# Altium schematic sheet Rolling_door.SchDoc
size A3; SheetNumber: 1; SheetTotal: 2
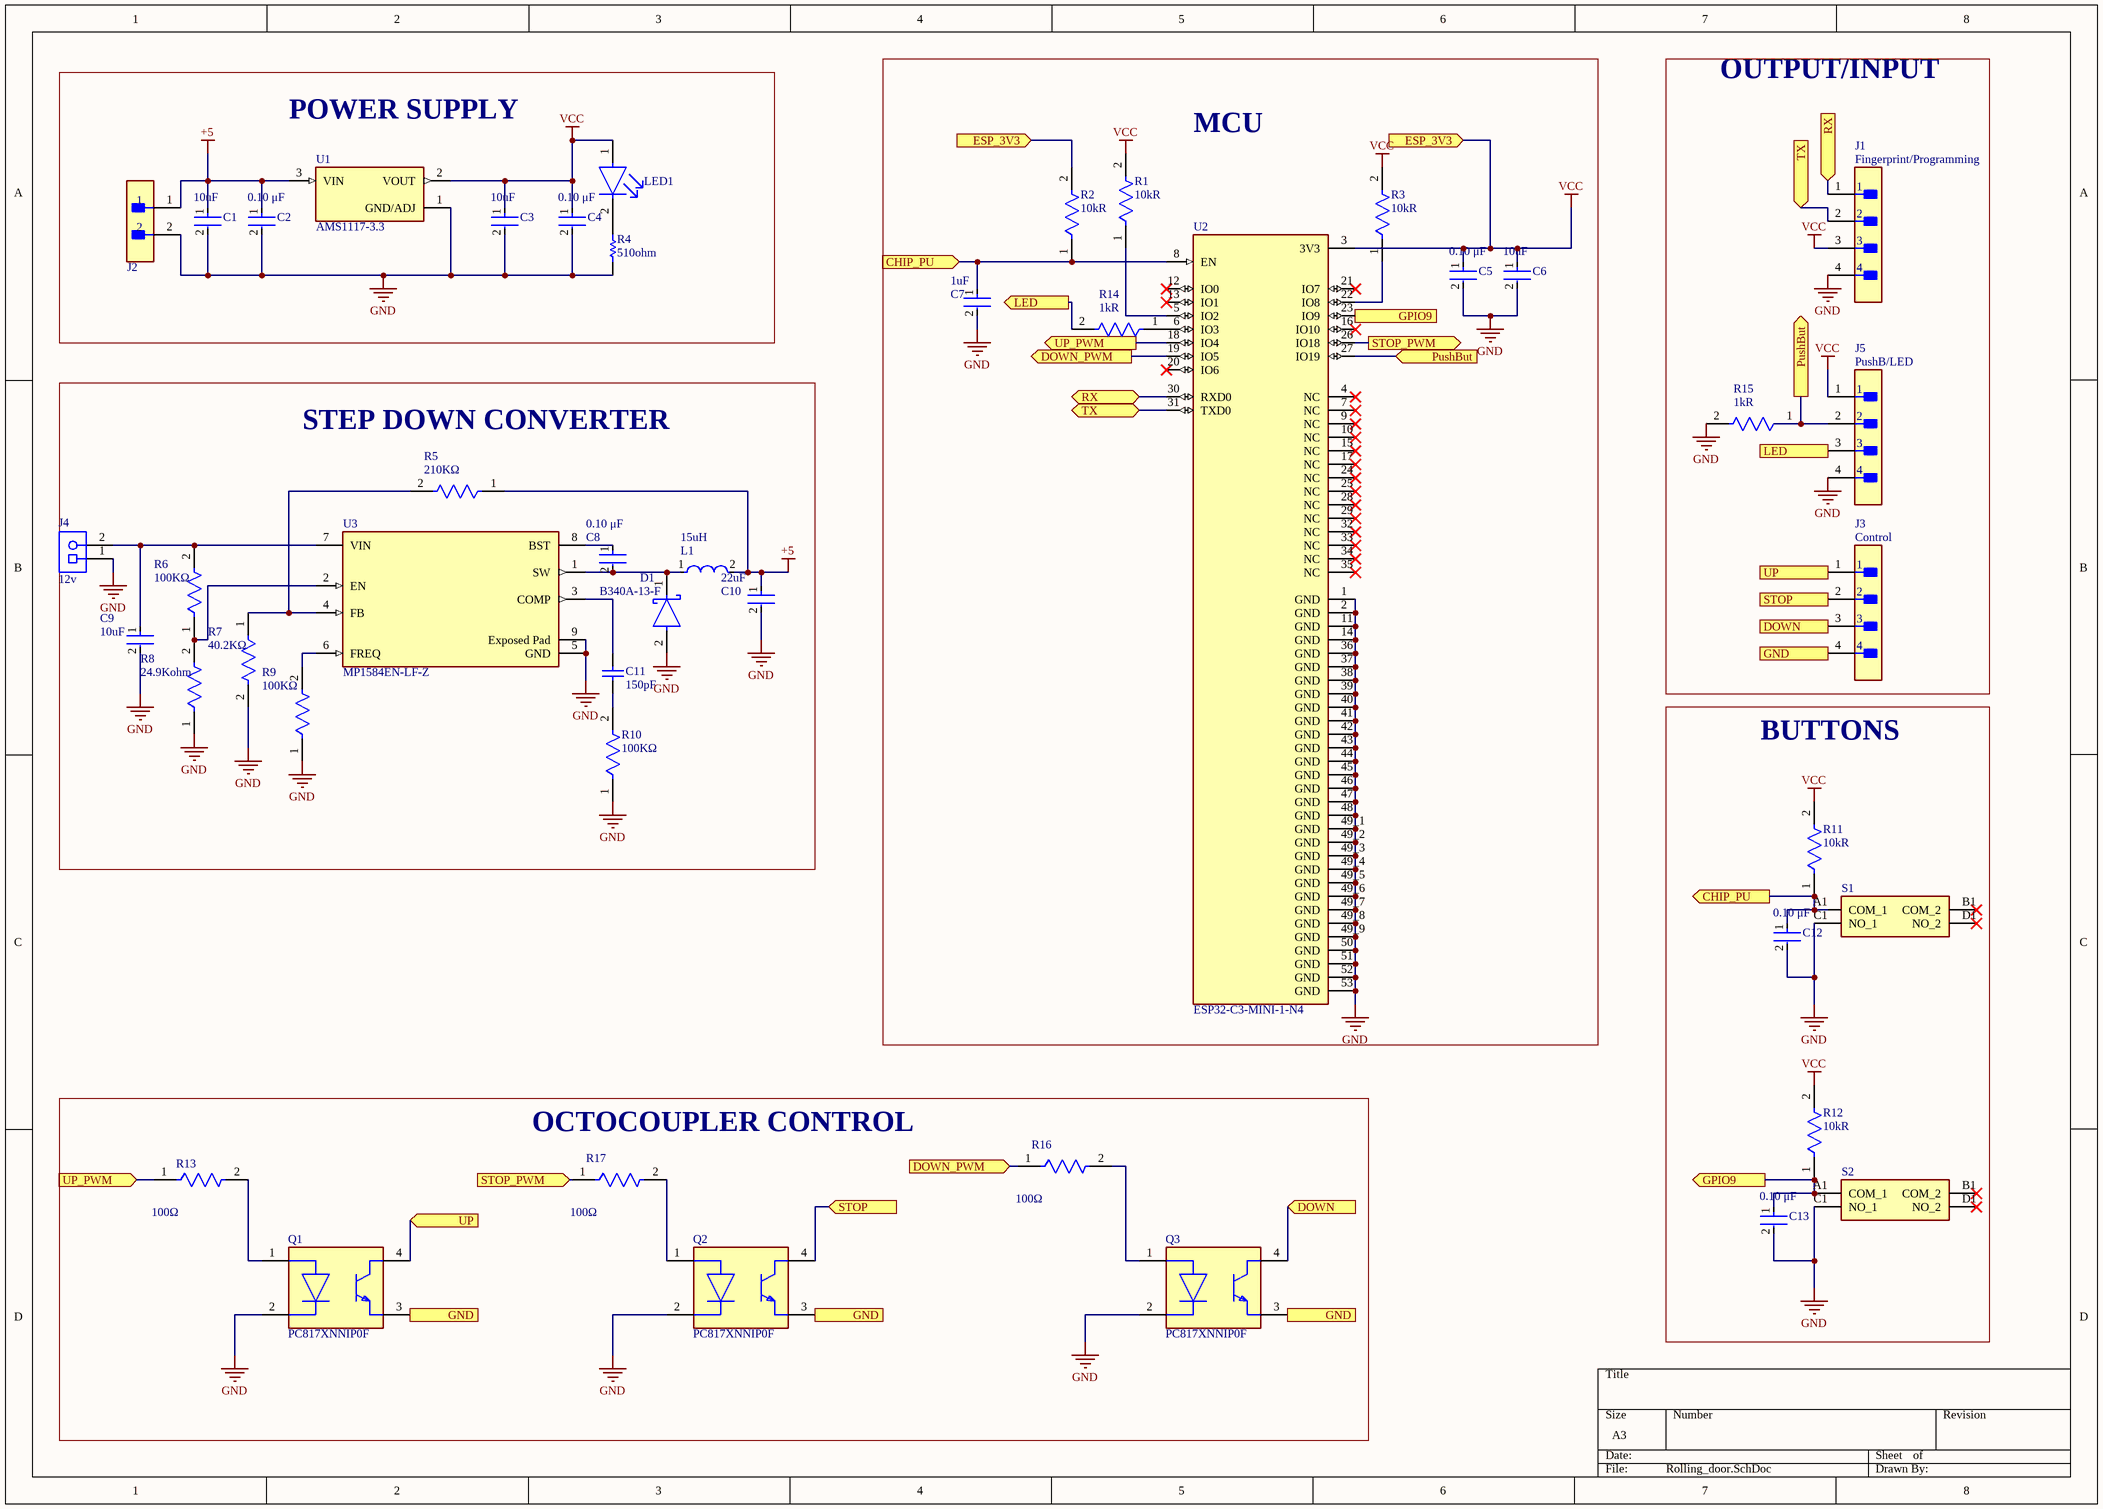
[diagram p0: Rolling_door.SchDoc]

## Parts
C1  Capacitance: 10uF  [FP-CL10-IPC_A]  (hidden comment: CL10X106MO8NRNC)
C2  Capacitance: 0.10 μF  [FP-C0603C-CF-MFG]  (hidden comment: C0603C104M4RAC7411)
C3  Capacitance: 10uF  [FP-CL10-IPC_A]  (hidden comment: CL10X106MO8NRNC)
C4  Capacitance: 0.10 μF  [FP-C0603C-CF-MFG]  (hidden comment: C0603C104M4RAC7411)
C5  Capacitance: 0.10 μF  [FP-C0603C-CF-MFG]  (hidden comment: C0603C104M4RAC7411)
C6  Capacitance: 10uF  [FP-CL10-IPC_A]  (hidden comment: CL10X106MO8NRNC)
C7  Capacitance: 1uF  [FP-0603-L_1_6_0_1-W_0_8_0-IPC_C]  (hidden comment: EMK107B7105KA-T)
C8  Capacitance: 0.10 μF  [FP-C0603C-CF-MFG]  (hidden comment: C0603C104M4RAC7411)
C9  Parameter 1: 10uF  [FP-GRM21B-0_2-e0_2_0_7-IPC_A]  (hidden comment: GRM21BR61H106ME43K)
C10  Capacitance: 22uF  [FP-GRM188-0_2-IPC_C]  (hidden comment: GRM188R60J226MEA0J)
C11  Capacitance: 150pF  [WCAP-CSGP_0603_L1.6W0.8H0.8_Reflow]  (hidden comment: 885012206029)
C12  Capacitance: 0.10 μF  [FP-C0603C-CF-MFG]  (hidden comment: C0603C104M4RAC7411)
C13  Capacitance: 0.10 μF  [FP-C0603C-CF-MFG]  (hidden comment: C0603C104M4RAC7411)
D1  B340A-13-F  [FP-SMA-MFG]
J1  value Fingerprint/Programming  [FP-B4B-XH-A_LF_SN-MFG]  (hidden comment: B4B-XH-A(LF)(SN))
J2  B2B-EH-A(LF)(SN)  [FP-B2B-EH-A_LF_SN-MFG]  (value not drawn)
J3  value Control  [FP-B4B-XH-A_LF_SN-MFG]  (hidden comment: B4B-XH-A(LF)(SN))
J4  Parameter 1: 12v  [PHOE-1729128-2_V]  (hidden comment: 1729128)
J5  value PushB/LED  [FP-B4B-XH-A_LF_SN-MFG]  (hidden comment: B4B-XH-A(LF)(SN))
L1  Parameter 1: 15uH  [FP-IHLP-3232DZ-FP_2_413x5-MFG]  (hidden comment: IHLP3232DZER150M5A)
LED1  SM0805UBWC  [FP-SM0805UBWC-MFG]  (value not drawn)
Q1  PC817XNNIP0F  [FP-PC817XNNIP0F-MFG]
Q2  PC817XNNIP0F  [FP-PC817XNNIP0F-MFG]
Q3  PC817XNNIP0F  [FP-PC817XNNIP0F-MFG]
R1  Resistance: 10kR  [FP-ESR03-IPC_C]  (hidden comment: ESR03EZPJ103)
R2  Resistance: 10kR  [FP-ESR03-IPC_C]  (hidden comment: ESR03EZPJ103)
R3  Resistance: 10kR  [FP-ESR03-IPC_C]  (hidden comment: ESR03EZPJ103)
R4  Parameter 1: 510ohm  [RESC1609X50X30NL10T20]  (hidden comment: CRCW0603510RFKEA)
R5  Resistance: 210KΩ  [FP-SR0603-MFG]
R6  Resistance: 100KΩ  [FP-SR0603-MFG]  (hidden comment: SR0603FR-7T100KL)
R7  Resistance: 40.2KΩ  [FP-SR0603-MFG]
R8  Parameter 1: 24.9Kohm  [FP-ESR03-IPC_C]  (hidden comment: ESR03EZPD2492)
R9  Resistance: 100KΩ  [FP-SR0603-MFG]  (hidden comment: SR0603FR-7T100KL)
R10  Resistance: 100KΩ  [FP-SR0603-MFG]  (hidden comment: SR0603FR-7T100KL)
R11  Resistance: 10kR  [FP-ESR03-IPC_C]  (hidden comment: ESR03EZPJ103)
R12  Resistance: 10kR  [FP-ESR03-IPC_C]  (hidden comment: ESR03EZPJ103)
R13  Resistance: 100Ω  [FP-SR0603-MFG]  (hidden comment: SR0603FR-7T100RL)
R14  Parameter 1: 1kR  [FP-ESR03-IPC_C]  (hidden comment: ESR03EZPJ103)
R15  Parameter 1: 1kR  [FP-ESR03-IPC_C]  (hidden comment: ESR03EZPJ103)
R16  Resistance: 100Ω  [FP-SR0603-MFG]  (hidden comment: SR0603FR-7T100RL)
R17  Resistance: 100Ω  [FP-SR0603-MFG]  (hidden comment: SR0603FR-7T100RL)
S1  TS-1187A-B-A-B  [TS1187ABAB]  (value not drawn)
S2  TS-1187A-B-A-B  [TS1187ABAB]  (value not drawn)
U1  AMS1117-3.3  [SOT229P700X180-4N]
U2  ESP32-C3-MINI-1-N4  [XCVR_ESP32-C3-MINI-1-N4]
U3  MP1584EN-LF-Z  [FP-MP1584EN-LF-Z-MFG]

## Blocks framed on the sheet
MCU: C5-C7 R1-R3 R14 U2
OUTPUT/INPUT: J1 J3 J5 R15
POWER SUPPLY: C1-C4 J2 LED1 R4 U1
STEP DOWN CONVERTER: C8-C11 D1 J4 L1 R5-R10 U3
BUTTONS: C12 C13 R11 R12 S1 S2
OCTOCOUPLER CONTROL: Q1-Q3 R13 R16 R17

## Ports
CHIP_PU (in, see Rolling_door[7C], Sheet1[3A], Sheet1[7B]), CHIP_PU (out, see Rolling_door[4A], Sheet1[3A], Sheet1[7B]), DOWN (in, see Rolling_door[7B], Sheet1[2D], Sheet1[6C]), DOWN (out, see Rolling_door[5D], Sheet1[2D], Sheet1[6C]), DOWN_PWM (in, see Rolling_door[4A], Sheet1[3A], Sheet1[4C]), DOWN_PWM (out, see Rolling_door[4D], Sheet1[3A], Sheet1[4C]), ESP_3V3 (in, see Rolling_door[4A], Sheet1[3A], Sheet1[4A]), ESP_3V3 (in, see Rolling_door[6A], Sheet1[3A], Sheet1[4A]), GND (in, see Rolling_door[2D], Rolling_door[4D], Rolling_door[7B], Sheet1[2D], Sheet1[3C], Sheet1[4C], Sheet1[6C]), GND (in, see Rolling_door[2D], Rolling_door[5D], Rolling_door[7B], Sheet1[2D], Sheet1[3C], Sheet1[4C], Sheet1[6C]), GND (in, see Rolling_door[4D], Rolling_door[5D], Rolling_door[7B], Sheet1[2D], Sheet1[3C], Sheet1[4C], Sheet1[6C]), GND (out, see Rolling_door[2D], Rolling_door[4D], Rolling_door[5D], Sheet1[2D], Sheet1[3C], Sheet1[4C], Sheet1[6C]), GPIO9 (in, see Rolling_door[7D], Sheet1[4A], Sheet1[7C]), GPIO9 (out, see Rolling_door[6A], Sheet1[4A], Sheet1[7C]), LED (in, see Rolling_door[4A], Sheet1[3A], Sheet1[8A]), LED (out, see Rolling_door[7B], Sheet1[3A], Sheet1[8A]), PushBut (in, see Rolling_door[7B], Sheet1[4A], Sheet1[8A]), PushBut (out, see Rolling_door[6A], Sheet1[4A], Sheet1[8A]), RX (bidir, see Rolling_door[7A], Sheet1[3A], Sheet1[8A]), RX (in, see Rolling_door[5B], Sheet1[3A], Sheet1[8A]), STOP (in, see Rolling_door[7B], Sheet1[2D], Sheet1[4C]), STOP (out, see Rolling_door[4D], Sheet1[2D], Sheet1[4C]), STOP_PWM (in, see Rolling_door[6A], Sheet1[3C], Sheet1[4A]), STOP_PWM (out, see Rolling_door[2D], Sheet1[3C], Sheet1[4A]), TX (bidir, see Rolling_door[7A], Sheet1[3A], Sheet1[8A]), TX (in, see Rolling_door[5B], Sheet1[3A], Sheet1[8A]), UP (in, see Rolling_door[7B], Sheet1[2C], Sheet1[2D]), UP (out, see Rolling_door[2D], Sheet1[2C], Sheet1[2D]), UP_PWM (in, see Rolling_door[4A], Sheet1[1C], Sheet1[3A]), UP_PWM (out, see Rolling_door[1D], Sheet1[1C], Sheet1[3A])

## Nets
+5: C1.1 C2.1 C10.1 J2.1 L1.2 R5.1 U1.3(VIN)
GND: C1.2 C2.2 C3.2 C4.2 C5.2 C6.2 C7.2 C9.2 C10.2 C12.2 C13.2 D1.2(A) J1.4 J2.2 J4.1 J5.4 Q1.2(C) Q2.2(C) Q3.2(C) R4.1 R7.2 R8.1 R9.1 R10.1 R15.2 S1.C1(NO_1) S2.C1(NO_1) U1.1(GND/ADJ) U2.1(GND) U2.2(GND) U2.11(GND) U2.14(GND) U2.36(GND) U2.37(GND) U2.38(GND) U2.39(GND) U2.40(GND) U2.41(GND) U2.42(GND) U2.43(GND) U2.44(GND) U2.45(GND) U2.46(GND) U2.47(GND) U2.48(GND) U2.49_1(GND) U2.49_2(GND) U2.49_3(GND) U2.49_4(GND) U2.49_5(GND) U2.49_6(GND) U2.49_7(GND) U2.49_8(GND) U2.49_9(GND) U2.50(GND) U2.51(GND) U2.52(GND) U2.53(GND) U3.5(GND) U3.9(Exposed_Pad)
VCC: C3.1 C4.1 C5.1 C6.1 J1.3 J5.1 LED1.1(A) R1.2 R2.2 R3.2 R11.2 R12.2 U1.2(VOUT) U2.3(3V3) ; port ESP_3V3
CHIP_PU: C7.1 C12.1 R2.1 R11.1 S1.A1(COM_1) U2.8(EN) ; port CHIP_PU
DOWN: J3.3 Q3.4(C) ; port DOWN
DOWN_PWM: R16.1 U2.19(IO5) ; port DOWN_PWM
GND: J3.4 Q1.3(E) Q2.3(E) Q3.3(E) ; port GND  [a separate net that carries the same name]
GPIO9: C13.1 R12.1 S2.A1(COM_1) U2.23(IO9) ; port GPIO9
LED: J5.3 R14.2 ; port LED
PushBut: J5.2 R15.1 U2.27(IO19) ; port PushBut
RX: J1.1 U2.30(RXD0) ; port RX
STOP: J3.2 Q2.4(C) ; port STOP
STOP_PWM: R17.1 U2.26(IO18) ; port STOP_PWM
TX: J1.2 U2.31(TXD0) ; port TX
UP: J3.1 Q1.4(C) ; port UP
UP_PWM: R13.1 U2.18(IO4) ; port UP_PWM
NetC8_1: C8.1 U3.8(BST)
NetC8_2: C8.2 D1.1(C) L1.1 U3.1(SW)
NetC9_1: C9.1 J4.2 R6.2 U3.7(VIN)
NetC11_1: C11.1 R10.2
NetC11_2: C11.2 U3.3(COMP)
NetLED1_2: LED1.2(C) R4.2
NetQ1_1: Q1.1(A) R13.2
NetQ2_1: Q2.1(A) R17.2
NetQ3_1: Q3.1(A) R16.2
NetR1_1: R1.1 U2.5(IO2)
NetR3_1: R3.1 U2.22(IO8)
NetR5_2: R5.2 R7.1 U3.4(FB)
NetR6_1: R6.1 R8.2 U3.2(EN)
NetR9_2: R9.2 U3.6(FREQ)
NetR14_1: R14.1 U2.6(IO3)

Not connected (* = marked no-connect by the designer): S1 B1(COM_2)* D1(NO_2)*; S2 B1(COM_2)* D1(NO_2)*; U2 4(NC)* 7(NC)* 9(NC)* 10(NC)* 12(IO0)* 13(IO1)* 15(NC)* 16(IO10)* 17(NC)* 20(IO6)* 21(IO7)* 24(NC)* 25(NC)* 28(NC)* 29(NC)* 32(NC)* 33(NC)* 34(NC)* 35(NC)*

## Library data of the parts
C1 C3 C6 = CMP-13271-003287-1: Cap Ceramic 10uF 16V X6S ±20% Pad SMD 0603 +105°C T/R; Thickness: 0.035inch; Mount: Surface Mount; Length: 0.063inch; Voltage Rating: 16V; Case Code (Imperial): 0603; Case/Package: 0603; Max Operating Temperature: 105°C; Tolerance: 20%; Case Code (Metric): 1608; Width: 0.031inch; Min Operating Temperature: -55°C; Packaging: Tape and Reel
C2 C4 C5 C8 C12 C13 = CMP-03020-016578-1: CAP CER 0.1UF 16V X7R 0603; Manufacturer: KEMET; Tolerance: 0.2; Value: 0.10 μF; Automotive Grade: Grade 1; Material: Ceramic; Temperature Coefficient: 30ppm/°C; RoHS: TRUE; Temperature: -55°C to +125°C; Automotive: Yes; Device Class L3: Ceramic Capacitors; Temperature Characteristic: X7R; Package: C0603C-CF; Digikey Description: CAP CER 0.1UF 16V X7R 0603; Manufacturer Part Number: C0603C104M4RAC7411; ComponentLink2URL: https://api.kemet.com/component-edge/download/datasheet/C0603C100J5GACAUTO.pdf; Mouser Description: Multilayer Ceramic Capacitors MLCC - SMD/SMT 16volts 0.1uF X7R 20%; Voltage Rating: 16 V; Temperature Range High: +125°C; Temperature Range Low: -55°C; Height: 0.87mm; Device Class L1: Passive Components; ComponentLink2Description: Datasheet; Lead Free: Yes; Category: Cap; Device Class L2: Capacitors; Octopart: https://octopart.com/c0603c104m4rac7411-kemet-9138805
C7 = CMP-14477-000018-3: None; Voltage Rating (DC): 16V; Dielectric: X7R; Tolerance: 10%; Halogen Free: Halogen Free; Height: 0.8mm; REACH SVHC: No SVHC; Contact Plating: Nickel; Number of Pins: 2; Resistor Type: Ceramic; Series: M; Thickness: 0.035inch; Construction: Flat; Voltage Rating: 16V; Packaging: Tape and Reel; Width: 0.031inch; Length: 1.6mm; Case Code (Metric): 1608; RoHS Compliant: Yes; Termination: SMD/SMT; Min Operating Temperature: -55°C; Case/Package: 0603; Mount: Surface Mount; Case Code (Imperial): 0603; Depth: 0.8mm; Package Quantity: 1; Max Operating Temperature: 125°C; Lead Free: Lead Free; Radiation Hardening: No
C9 = CMP-06035-037648-1: Chip Multilayer Ceramic Capacitors for General Purpose, 0805, 10uF, X5R, 15%, 20%, 50V
C10 = CMP-06035-027361-1: Chip Multilayer Ceramic Capacitors for General Purpose, 0603, 22uF, X5R, 15%, 20%, 6.3V; Case Code (Metric): 1608; Thickness: 0.039inch; Dielectric: X5R; Voltage Rating: 6.3V; Termination: SMD/SMT; Voltage Rating (DC): 6.3V; Width: 0.031inch; Weight: 0.000222oz; Tolerance: 20%; Case/Package: 0603; Lead Free: Lead Free; Package Quantity: 10000; Case Code (Imperial): 0603; Length: 0.063inch; Packaging: Tape and Reel; Max Operating Temperature: 85°C; Min Operating Temperature: -55°C; Mount: Surface Mount
C11 = CMP-03913-53914738-1: 885012206029 Ceramic Capacitor 150pF, 16VDC, 0603, ±10 %; Voltage Rating (DC): 16V; Tolerance: 10%; Insulation Resistance: 10GΩ; Dielectric: X7R; Max Operating Temperature: 125°C; Case/Package: 0603; Length: 1.6mm; Voltage Rating: 16V; Width: 800µm; Case Code (Imperial): 0603; RoHS: Compliant; Min Operating Temperature: -55°C; Thickness: 863.6µm; Packaging: Tape & Reel (TR); Height: 800µm; Mount: Surface Mount; NexarPartId: 53914738; Case Code (Metric): 1608
D1 = CMP-1667-00003-3: DIODE SCHOTTKY 40V 3A SMA; Max Forward Surge Current (Ifsm): 80A; Forward Voltage: 500mV; Polarity: Standard; Max Reverse Current: 500uA; Capacitance: 250pF; Element Configuration: Single; Mount: Surface Mount; Output Current: 3A; Radiation Hardening: No; Width: 2.92mm; Current Rating: 3A; Termination: SMD/SMT; Voltage: 40V; Series: -; Max Operating Temperature: 125°C; Current: 3A; Max Repetitive Reverse Voltage (Vrrm): 40V; Min Operating Temperature: -55°C; REACH SVHC: No SVHC; Number of Pins: 2; Average Rectified Current: 3A; Contact Plating: Tin; RoHS Compliant: Yes; Max Reverse Voltage (DC): 40V; Packaging: Tape and Reel; Height: 2.3mm; Length: 4.6mm; Case/Package: SMA; Weight: 0.002258oz; Peak Non-Repetitive Surge Current: 80A; Package Quantity: 5000; Lead Free: Lead Free; Forward Current: 3A; Voltage Rating (DC): 40V
J1 J3 J5 = CMP-17439-000250-1: CONN HEADER VERT 4POS 2.5MM; Number of Contacts: 4; Contact Resistance: 20mR; Voltage Rating: 250V; Max Current Rating: 3A; Gender: Male; Wire/Cable Gauge: 22AWG; Mated Stacking Heights: 9.8mm; Insulation Resistance: 1GR; Orientation: Straight; Contact Type: Male Pin; Contact Finish - Mating: TIN; Series: XH; Max Voltage Rating (AC): 250V; Lead Pitch: 2.5mm; Contact Shape: Square; Insulation Color: Natural; Termination: Solder; Lead Free: Lead Free; Voltage Rating (AC): 250V; Number of Rows: 1; Flammability Rating: UL94 V-0; Number of Positions: 4; Max Operating Temperature: 85°C; Package Quantity: 500; Mount: Through Hole; REACH SVHC: No SVHC; Connector Type: Header; Insulation Material: Nylon; Fastening Type: Detent; Min Operating Temperature: -25°C; Housing Color: White; Packaging: Bulk; Contact Plating: Tin; Contact Material: Brass; Max Voltage Rating (DC): 250V; Housing Material: Polyamide; Color: Natural; Material: Polyamide; Pitch: 2.5mm; Depth: 5.75mm; Current Rating: 3A; Length: 12.4mm
J2 = CMP-17439-000026-1: CONN HEADER VERT 2POS 2.5MM; Number of Contacts: 2; Current Rating: 3A; Connector Type: Plug; Contact Resistance: 20mR; Gender: Male; Voltage Rating: 250V; Fastening Type: Detent; Depth: 3.8mm; Max Operating Temperature: 85°C; Orientation: Straight; Series: EH; Contact Plating: Tin; Min Operating Temperature: -25°C; Contact Type: Male Pin; Housing Color: White; Termination: Press-Fit; Housing Material: Nylon; Pitch: 2.5mm; Number of Positions: 2; Max Current Rating: 3A; Packaging: Bulk; Lead Free: Lead Free; Number of Rows: 1; Length: 7.5mm; Contact Mating Length: 0.13inch; Color: Natural; Max Voltage Rating (AC): 250V; Contact Material: Copper Alloy; Mount: Through Hole
J4 = CMP-2000-05815-1: PCB Terminal Block, 13.5 A, 400 V, 2-Pin THD, RoHS, Bulk; Manufacturer: Phoenix Contact; Package Version: 03/2015; No. of Rows: 1; Pitch: 5.08mm; No. of Positions: 2; Voltage Rating: 400V; Current Rating: 13500mA; Manufacturer URL: http://www.phoenixcontact.com/; Datasheet URL: https://datasheet.ciiva.com/16046/1729128-16046181.pdf; RoHS: TRUE; Package URL: https://www.phoenixcontact.com/online/portal/pi/pxc/product_detail_page/!ut/p/b1/3VdJjqNKFDxLH8AFycySyWY2ozFsEPOMMQaDOX1XedGL_1Vdm5YXJleknhSKeBkvI6EA8ncAo3AYoDhBQGco6KN7VURTdemj9us_IEKEZo_YHiPAEWEFmDGOHMORkqKYCORBZxgL7ZoaZYcbFFUZ3fqxSY6GOuxydWUuHqz1ynmMFygu583Bob0Ewr6Sd_l-5m-kAueHiB0jpRwZwe58wwtkpxtMYd_LmGcDRU02dRNEyWt6Y2ti5pSyJ_reIkzIulrqApdnbT11V5jnCKbYNCvhEM1MCpPByat_X379-iThf08CI5GfOPqfBeS3BRoBOdD55AKVv0iLwCMq-2BrzXWSGRH7pUGD9uwXQjiph3xL0DKQwdGa0JImiIOmBNOestqgwTHSSs2oOep-78apyXQBvNi8ZLaFjvjWvcaUEBu0MC6Wbe-d6mB0FAebo2lUWinqYaZs5DAYzV0RP9yitUjnGJ0iI9xhZkT42OCQNUJJhkgWINNQLP2JFP6OpMg3JCVg70jqHT0lvKOnhHf0lPuOnnLf0VPuWx6_dxwUIvwk5WMkT0kLL1mh61l2yZVSzG3pYV_bqo-mj6uMKwKwdnnW8Jh5RTOJzMOA5c-eJDaZQw4mTMPH02PvS_ZAqNVjVTo2WyYLkwH_KU1mmmG5kjRhDqPXLwwVHvVOjCM60-fpXvTDfMGW1PVFVS1r4e4yVDk4ZdNbkUHvqPqQSeian4UD39fNKmachqdJ1NJbyk8rXT9mXTvPk3oE5meulKGgiruPJek-4I9hTT6G8ZLOyRSm2RRVbThERQad5OS28hdt4YW4vG0stgYYzsWsK4_7y6DZMjJSCqri1kyiZR5vD7pwIrNR7QwPHTcLTI5qT7eRlpHrdGiupYlqQDJ7zy_CND8fWWBoLRXxk1RVcXiBQwbTD4Xi7KL-FuO94t9xaqweXzH; PartNumber: 1729128; Package Description: 2-Pin Through Hole Device, Body 8.1 x 10.16 mm, Pitch 5.08 mm; Datasheet Version: 12/2013; Mounting Technology: ThroughHole; Orientation: Horizontal; Package Reference: 1729128-2; Packing: Bulk
L1 = CMP-02424-000665-1: Automotive Inductors, High Temperature (155 °C) Series 15uH 4.8A 66.34mΩ 20%; Self Resonant Frequency: 10MHz; Test Frequency: 100kHz; DC Resistance (DCR): 66.34mR; Max DC Current: 3.6A; Shielding: Shielded; Depth: 8.26mm; Military Standard: Not; Length: 0.322inch; Lead Free: Lead Free; Height - Seated (Max): 0.158inch; Mount: Surface Mount; Height: 4mm; Current Rating: 4.8A; Max Operating Temperature: 155°C; Width: 0.322inch; Termination: SMD/SMT; Tolerance: 20%; Saturation Current: 3.6A; Case/Package: 3232; Min Operating Temperature: -55°C; Inductance: 15uH; Packaging: Tape and Reel; Package Quantity: 500
LED1 = CMP-35283-000004-1: LED BLUE CLEAR 0805 SMD; Dominant Wavelength: 470nm; Forward Voltage: 3.3V; Forward Current: 20mA; Lens Color: Colorless; Lens Style: Rectangular; Luminous Intensity: 115mcd; Viewing Angle: 130°; Power Rating: 100mW; Lens Transparency: Clear; Height: 1.1mm; Mount: Surface Mount; Packaging: Tape and Reel; Package Quantity: 3000; Illumination Color: Blue; Width: 1.2mm; Min Operating Temperature: -30°C; Case Code (Imperial): 0805; Length: 2mm; Test Current: 20mA; Max Operating Temperature: 80°C; Case Code (Metric): 2012; Color: Blue; Wavelength: 470nm; Case/Package: 0805; Lead Free: Lead Free; Number of Pins: 2
Q1-Q3 = CMP-65434-000005-1: OPTOISOLATOR 5KV TRANS 4SMD; Reverse Breakdown Voltage: 6V; Output Current per Channel: 30mA; Power Dissipation: 200mW; Collector-emitter Voltage-Max: 200mV; Max Output Voltage: 80V; Input Current: 50mA; Forward Voltage: 1.4V; Fall Time: 18000ns; Number of Elements: 1; Input Type: DC; Packaging: Tape and Reel; RoHS Compliant: Yes; Contact Plating: Copper; Min Operating Temperature: -30°C; Collector Emitter Saturation Voltage: 200mV; Max Input Current: 50mA; Radiation Hardening: No; Max Collector Current: 50mA; Case/Package: SMD/SMT; Mount: Surface Mount; Output Voltage: 80V; Forward Current: 50mA; Max Power Dissipation: 200mW; Collector Emitter Voltage (VCEO): 80V; Number of Channels: 1; Rise Time: 18000ns; Isolation Voltage: 5kV; Number of Pins: 4; Lead Free: Lead Free; Package Quantity: 2000; Isolation Voltage-Max: 5kV; Max Operating Temperature: 100°C
R1-R3 R11 R12 = CMP-08839-028975-1: 10kΩ ±5% 0.25W 0603 Anti-Surge Chip Resistor AEC-Q200; Power Rating: 250mW; Temperature Coefficient: 200ppm/°C; Tolerance: 5%; Series: ESR03; Package Quantity: 5000; Length: 0.063inch; Height: 0.022inch; Lead Free: Lead Free; Case/Package: 0603; Case Code (Metric): 1608; Width: 0.031inch; Resistor Type: Thick Film; Max Power Dissipation: 250mW; Packaging: Tape and Reel; Mount: Surface Mount; Number of Terminations: 2; Case Code (Imperial): 0603; Max Operating Temperature: 155°C; Min Operating Temperature: -55°C; RoHS Compliant: Yes
R4 = CMP-2000-03439-1: Manufacturer: Vishay Dale; Part Number: CRCW0603510RFKEA
R5 = CMP-03412-000894-1: RES SMD 0603 1/4W 1% 100K OHM; Manufacturer Part Number: SR0603FR-7T100KL; Manufacturer: Yageo; Tolerance: 0.01; Voltage Rating: 75V; Value: 210KΩ; Power Rating: 0.25W; Automotive Grade: Grade 0; Ipc Land Pattern Name: RESC16080X45; Digikey Description: RES SMD 0603 1/4W 1% 100K OHM; Device Class L3: Chip SMD Resistors; Octopart: https://octopart.com/sr0603fr-7t100kl-yageo-91478071; Lead Free: Yes; RoHS: TRUE; Series: SR; Device Class L1: Passive Components; ComponentLink2URL: http://www.yageo.com/documents/recent/PYu-SR_D_F%20tol_RoHS_L_3.pdf; ComponentLink2Description: Datasheet; Automotive: Yes; Category: Res; Temperature Range High: +155°C; Height: 0.55mm; Composition: Thick Film; Temperature Range Low: -55°C; Footprint Url: http://www.yageo.com/exep/pages/download/literatures/PYu-R_Mount_10.pdf; Device Class L2: Resistors; Temperature: -55°C to +155°C; Package: SR0603
R6 R9 R10 = CMP-03412-000894-1: RES SMD 0603 1/4W 1% 100K OHM; Manufacturer: Yageo; Tolerance: 0.01; Voltage Rating: 75V; Value: 100KΩ; Power Rating: 0.25W; Automotive Grade: Grade 0; Ipc Land Pattern Name: RESC16080X45; Digikey Description: RES SMD 0603 1/4W 1% 100K OHM; Device Class L3: Chip SMD Resistors; Octopart: https://octopart.com/sr0603fr-7t100kl-yageo-91478071; Lead Free: Yes; RoHS: TRUE; Series: SR; Device Class L1: Passive Components; ComponentLink2URL: http://www.yageo.com/documents/recent/PYu-SR_D_F%20tol_RoHS_L_3.pdf; ComponentLink2Description: Datasheet; Automotive: Yes; Category: Res; Temperature Range High: +155°C; Manufacturer Part Number: SR0603FR-7T100KL; Height: 0.55mm; Composition: Thick Film; Temperature Range Low: -55°C; Footprint Url: http://www.yageo.com/exep/pages/download/literatures/PYu-R_Mount_10.pdf; Device Class L2: Resistors; Temperature: -55°C to +155°C; Package: SR0603
R7 = CMP-03412-000894-1: RES SMD 0603 1/4W 1% 100K OHM; Manufacturer Part Number: SR0603FR-7T100KL; Manufacturer: Yageo; Tolerance: 0.01; Voltage Rating: 75V; Value: 40.2KΩ; Power Rating: 0.25W; Automotive Grade: Grade 0; Ipc Land Pattern Name: RESC16080X45; Digikey Description: RES SMD 0603 1/4W 1% 100K OHM; Device Class L3: Chip SMD Resistors; Octopart: https://octopart.com/sr0603fr-7t100kl-yageo-91478071; Lead Free: Yes; RoHS: TRUE; Series: SR; Device Class L1: Passive Components; ComponentLink2URL: http://www.yageo.com/documents/recent/PYu-SR_D_F%20tol_RoHS_L_3.pdf; ComponentLink2Description: Datasheet; Automotive: Yes; Category: Res; Temperature Range High: +155°C; Height: 0.55mm; Composition: Thick Film; Temperature Range Low: -55°C; Footprint Url: http://www.yageo.com/exep/pages/download/literatures/PYu-R_Mount_10.pdf; Device Class L2: Resistors; Temperature: -55°C to +155°C; Package: SR0603
R8 = CMP-08839-029638-1: 24.9kΩ ±0.5% 0.25W 0603 Anti-Surge Chip Resistor AEC-Q200; RoHS Compliant: Yes
R13 R16 R17 = CMP-03412-002710-1: RES SMD 0603 1/4W 1% 100 OHM; Manufacturer: Yageo; Power Rating: 0.25W; Voltage Rating: 75V; Automotive Grade: Grade 0; Tolerance: 0.01; Value: 100Ω; Height: 0.55mm; Device Class L2: Resistors; RoHS: TRUE; Temperature Range High: +155°C; Device Class L3: Chip SMD Resistors; Category: Res; Device Class L1: Passive Components; Manufacturer Part Number: SR0603FR-7T100RL; Temperature Range Low: -55°C; Temperature: -55°C to +155°C; Lead Free: Yes; Octopart: https://octopart.com/sr0603fr-7t100rl-yageo-91478072; ComponentLink2URL: http://www.yageo.com/documents/recent/PYu-SR_D_F%20tol_RoHS_L_3.pdf; Series: SR; Automotive: Yes; Footprint Url: http://www.yageo.com/exep/pages/download/literatures/PYu-R_Mount_10.pdf; Package: SR0603; ComponentLink2Description: Datasheet; Composition: Thick Film; Ipc Land Pattern Name: RESC16080X45; Digikey Description: RES SMD 0603 1/4W 1% 100 OHM
R14 R15 = CMP-08839-028975-1: 10kΩ ±5% 0.25W 0603 Anti-Surge Chip Resistor AEC-Q200; Resistance: 10kR; Power Rating: 250mW; Temperature Coefficient: 200ppm/°C; Tolerance: 5%; Series: ESR03; Package Quantity: 5000; Length: 0.063inch; Height: 0.022inch; Lead Free: Lead Free; Case/Package: 0603; Case Code (Metric): 1608; Width: 0.031inch; Resistor Type: Thick Film; Max Power Dissipation: 250mW; Packaging: Tape and Reel; Mount: Surface Mount; Number of Terminations: 2; Case Code (Imperial): 0603; Max Operating Temperature: 155°C; Min Operating Temperature: -55°C; RoHS Compliant: Yes
S1 S2 = TS-1187A-B-A-B: Switch; Manufacturer_Name: XKB Connectivity; Datasheet Link: http://www.helloxkb.com/public/images/pdf/TS-1187A-X-X-X.pdf; Height: 4.05mm; Manufacturer_Part_Number: TS-1187A-B-A-B
U1 = AMS1117-3.3: Sot223/Pkg 1-Amp 3.3-Volt Low Drop Out Voltage Regulatator; MF: Advanced Monolithic Systems; Package: SOT-223 Seeed Technology; Value: *; Check_prices: https://www.snapeda.com/parts/AMS1117-3.3/Advanced+Monolithic+Systems/view-part/?ref=eda; Price: None; Availability: Not in stock; MP: AMS1117-3.3; SnapEDA_Link: https://www.snapeda.com/parts/AMS1117-3.3/Advanced+Monolithic+Systems/view-part/?ref=snap
U2 = ESP32-C3-MINI-1-N4: Bluetooth, WiFi 802.11b/g/n, Bluetooth v5.0 Transceiver Module 2.412GHz ~ 2.484GHz PCB Trace Surface Mount; MF: Espressif Systems; SnapEDA_Link: https://www.snapeda.com/parts/ESP32-C3-MINI-1-N4/Espressif+Systems/view-part/?ref=snap; Package: SMD-53 Espressif Systems; Value: *; MP: ESP32-C3-MINI-1-N4; Check_prices: https://www.snapeda.com/parts/ESP32-C3-MINI-1-N4/Espressif+Systems/view-part/?ref=eda
U3 = CMP-57379-000006-1: IC REG BUCK ADJ 3A; Manufacturer: Monolithic Power Systems; Output Type: AdjustableProgrammable; Nominal Supply Current: 100uA; Switching Frequency: 100-1500kHz; Max Power Dissipation: 2.5W; Output Voltage: 0.8-25V; Max Junction Temp: +125°C; Min Supply Voltage: 4.5V; Max Supply Voltage: 28V; Number Of Outputs: 1; Standoff Height: 0mm; ComponentLink2URL: https://www.monolithicpower.com/en/documentview/productdocument/index/doc_url/L01QMTU4NF9yMS4wLnBkZg%3D%3D/release_date/MjAwOS0wNC0wOSAwMDowMDowMA%3D%3D/; Lead Free: Yes; Package: MP1584EN-LF-Z; Temperature Range Low: -20°C; Temperature: -20°C to +125°C; Height: 1.7mm; Ambient Temperature Range Low: -20°C; RoHS: TRUE; Automotive: No; Ipc Land Pattern Name: SOIC127P600X150-8; Ambient Temperature Range High: +85°C; Device Class L2: Power Management ICs; ComponentLink2Description: Datasheet; Manufacturer Part Number: MP1584EN-LF-Z; Device Class L3: Voltage Regulators - Switching; Octopart: https://octopart.com/mp1584en-lf-z-monolithic+power+systems-18629680; Category: IC; Output Current: 3A; Digikey Description: IC REG BUCK ADJ 3A; Temperature Range High: +125°C; Device Class L1: Integrated Circuits (ICs); Switching Topology: Buck